# EAGLE design UsbTinyThermometer (EAGLE 5.10)
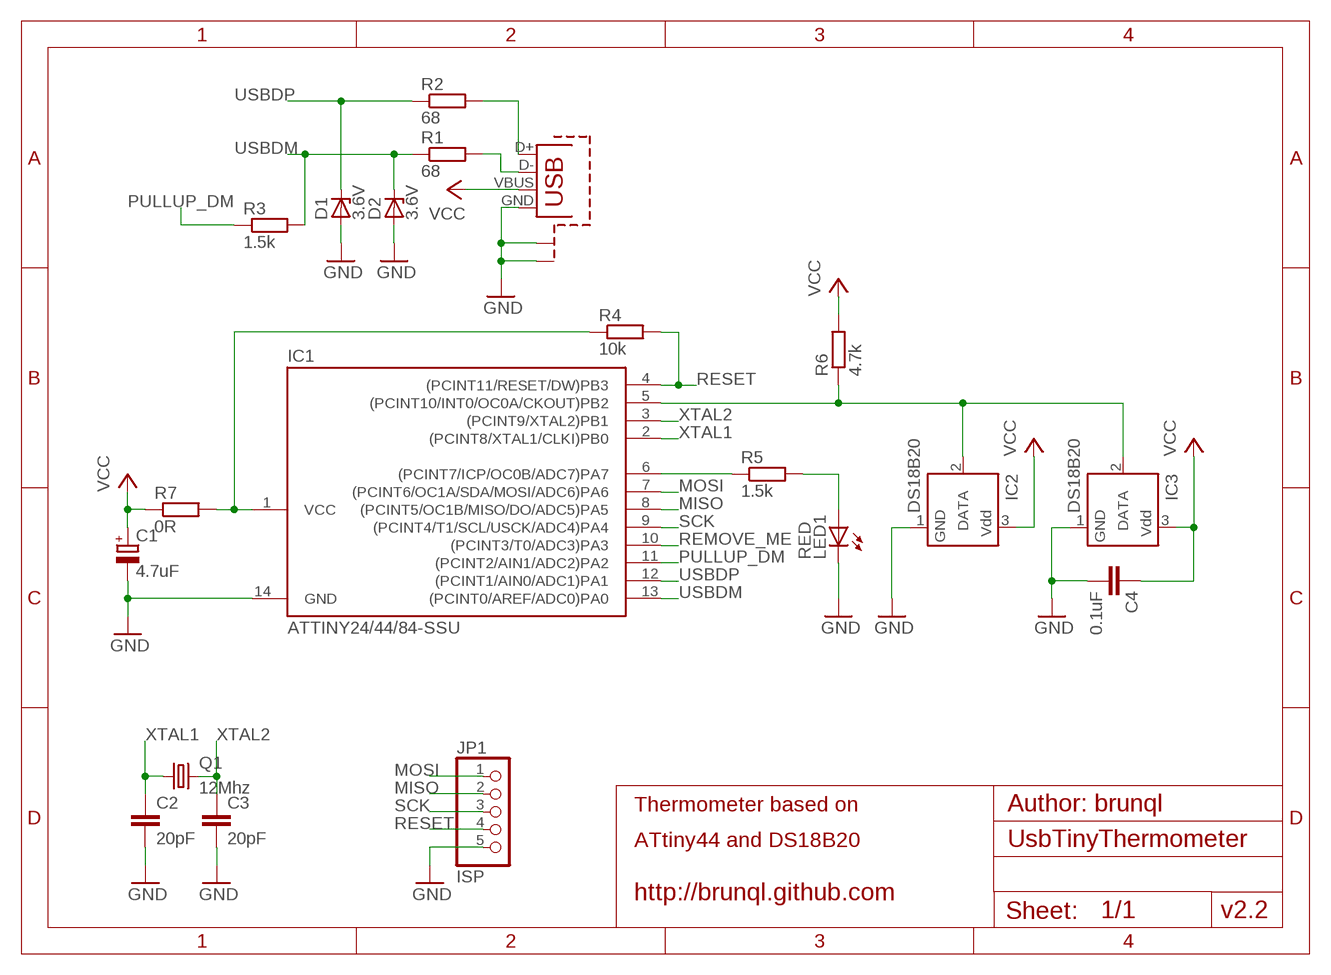
[diagram p0: schematic, sheet 1]

## Parts
C1  4.7uF  CPOL-EUE2.5-5  [E2,5-5]
C2  20pF  C-EUC1206  [C1206]
C3  20pF  C-EUC1206  [C1206]
C4  0.1uF  C-EUC0805  [C0805]
D1  3.6V  ZENER-DIODESMB  [SMB]
D2  3.6V  ZENER-DIODESMB  [SMB]
IC1  ATTINY24/44/84-SSU  [SOIC14]
IC2  DS18B20  [TO92-]
IC3  DS18B20  [TO92-]
JP1  ISP  PINHD-1X5  [1X05]
LED1  RED  LEDCHIP-LED0805  [CHIP-LED0805]
Q1  12Mhz  CRYSTALHC49S  [HC49/S]
R1  68  R-EU_R0805  [R0805]
R2  68  R-EU_R0805  [R0805]
R3  1.5k  R-EU_R0805  [R0805]
R4  10k  R-EU_R0805  [R0805]
R5  1.5k  R-EU_R0805  [R0805]
R6  4.7k  R-EU_M1206  [M1206]
R7  0R  R-EU_M1206  [M1206]
X1  USB-A-H  [USB-A-H]

## Nets
GND: C1.- C2.2 C3.2 C4.2 D1.A D2.A IC1.14(GND) IC2.1(GND) IC3.1(GND) JP1.5 LED1.C X1.GND X1.SHIELD1 X1.SHIELD2
MISO: IC1.8((PCINT5/OC1B/MISO/DO/ADC5)PA5) JP1.2
MOSI: IC1.7((PCINT6/OC1A/SDA/MOSI/ADC6)PA6) JP1.1
N$1: IC1.5((PCINT10/INT0/OC0A/CKOUT)PB2) IC2.2(DATA) IC3.2(DATA) R6.1
N$2: LED1.A R5.2
N$3: IC1.1(VCC) R4.1 R7.2
N$4: R1.2 X1.D-
N$5: R2.2 X1.D+
N$7: IC1.6((PCINT7/ICP/OC0B/ADC7)PA7) R5.1
PULLUP_DM: IC1.11((PCINT2/AIN1/ADC2)PA2) R3.1
REMOVE_ME: IC1.10((PCINT3/T0/ADC3)PA3)
RESET: IC1.4((PCINT11/RESET/DW)PB3) JP1.4 R4.2
SCK: IC1.9((PCINT4/T1/SCL/USCK/ADC4)PA4) JP1.3
USBDM: D2.C IC1.13((PCINT0/AREF/ADC0)PA0) R1.1 R3.2
USBDP: D1.C IC1.12((PCINT1/AIN0/ADC1)PA1) R2.1
VCC: C1.+ C4.1 IC2.3(VDD) IC3.3(VDD) R6.2 R7.1 X1.VBUS
XTAL1: C2.1 IC1.2((PCINT8/XTAL1/CLKI)PB0) Q1.1
XTAL2: C3.1 IC1.3((PCINT9/XTAL2)PB1) Q1.2

## Notes on the sheet
- Thermometer based on | Author: brunql
- ATtiny44 and DS18B20
- http://brunql.github.com
- v2.2

## Library data of the parts
C1 = rcl:CPOL-EU: POLARIZED CAPACITOR, European symbol
C2-C4 = rcl:C-EU: CAPACITOR, European symbol
D1 D2 = diode:ZENER-DIODE: Z-Diode
IC1 = attiny24_44_84:ATTINY24/44/84
IC2 IC3 = dallas:DS18B20: 1-Wire Thermometer DALLAS Semiconductor DS18B20
JP1 = pinhead:PINHD-1X5: PIN HEADER
LED1 = led:LED: LED OSRAM: - CHIPLED LG R971, LG N971, LY N971, LG Q971, LY Q971, LO R971, LY R971 LH N974, LH R974 LS Q976, LO Q976, LY Q976 LO Q996 - Hyper CHIPLED LW Q18S LB Q993, LB Q99A, LB R99A - SideLED LS A670, LO A670, LY A670, LG A670, LP A670 LB A673, LV A673, LT A673, LW A673 LH A674 LY A675 LS A676, LA A676, LO A676, LY A676, LW A676 LS A679, LY A679, LG A679 - Hyper Micro SIDELED® LS Y876, LA Y876, LO Y876, LY Y876 LT Y87S - SmartLED LW L88C, LW L88S LB L89C, LB L89S, LG L890 LS L89K, LO L89K, LY L89K LS L896, LA L896, LO L896, LY L896 - TOPLED LS T670, LO T670, LY T670, LG T670, LP T670 LSG T670, LSP T670, LSY T670, LOP T670, LYG T670 LG T671, LOG T671, LSG T671 LB T673, LV T673, LT T673, LW T673 LH T674 LS T676, LA T676, LO T676, LY T676, LB T676, LH T676, LSB T676, LW T676 LB T67C, LV T67C, LT T67C, LS T67K, LO T67K, LY T67K, LW E67C LS E67B, LA E67B, LO E67B, LY E67B, LB E67C, LV E67C, LT E67C LW T67C LS T679, LY T679, LG T679 LS T770, LO T770, LY T770, LG T770, LP T770 LB T773, LV T773, LT T773, LW T773 LH T774 LS E675, LA E675, LY E675, LS T675 LS T776, LA T776, LO T776, LY T776, LB T776 LHGB T686 LT T68C, LB T68C - Hyper Mini TOPLED® LB M676 - Mini TOPLED Santana® LG M470 LS M47K, LO M47K, LY M47K Source: http://www.osram.convergy.de LUXEON: - LUMILED® LXK2-PW12-R00, LXK2-PW12-S00, LXK2-PW14-U00, LXK2-PW14-V00 LXK2-PM12-R00, LXK2-PM12-S00, LXK2-PM14-U00 LXK2-PE12-Q00, LXK2-PE12-R00, LXK2-PE12-S00, LXK2-PE14-T00, LXK2-PE14-U00 LXK2-PB12-K00, LXK2-PB12-L00, LXK2-PB12-M00, LXK2-PB14-N00, LXK2-PB14-P00, LXK2-PB14-Q00 LXK2-PR12-L00, LXK2-PR12-M00, LXK2-PR14-Q00, LXK2-PR14-R00 LXK2-PD12-Q00, LXK2-PD12-R00, LXK2-PD12-S00 LXK2-PH12-R00, LXK2-PH12-S00 LXK2-PL12-P00, LXK2-PL12-Q00, LXK2-PL12-R00 Source: www.luxeon.com KINGBRIGHT: KA-3528ASYC Source: www.kingbright.com
Q1 = crystal:CRYSTAL: CRYSTAL
R1-R7 = rcl:R-EU_: RESISTOR, European symbol
X1 = con-usb:USB: USB Connectors

## Board
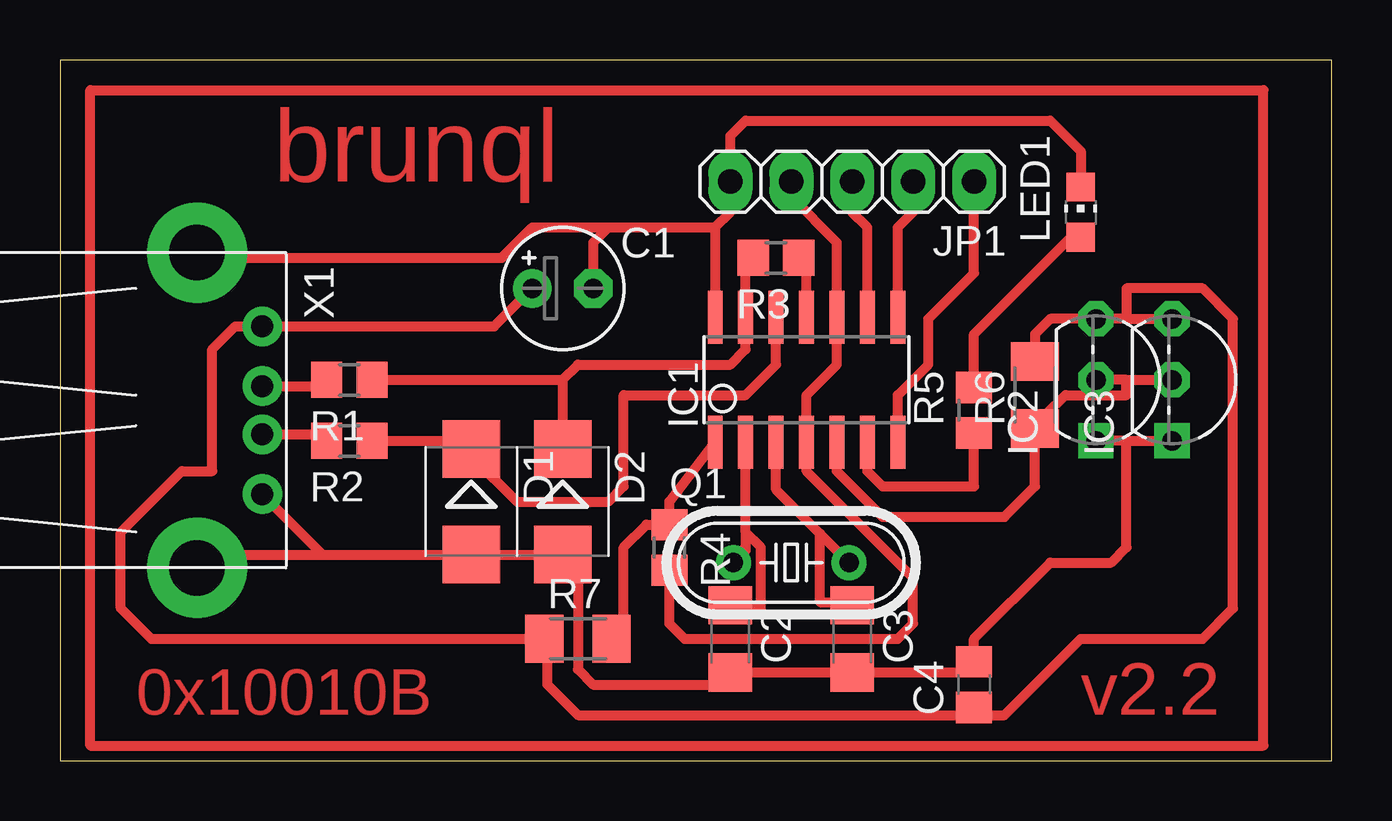
[diagram p1: board, top side]
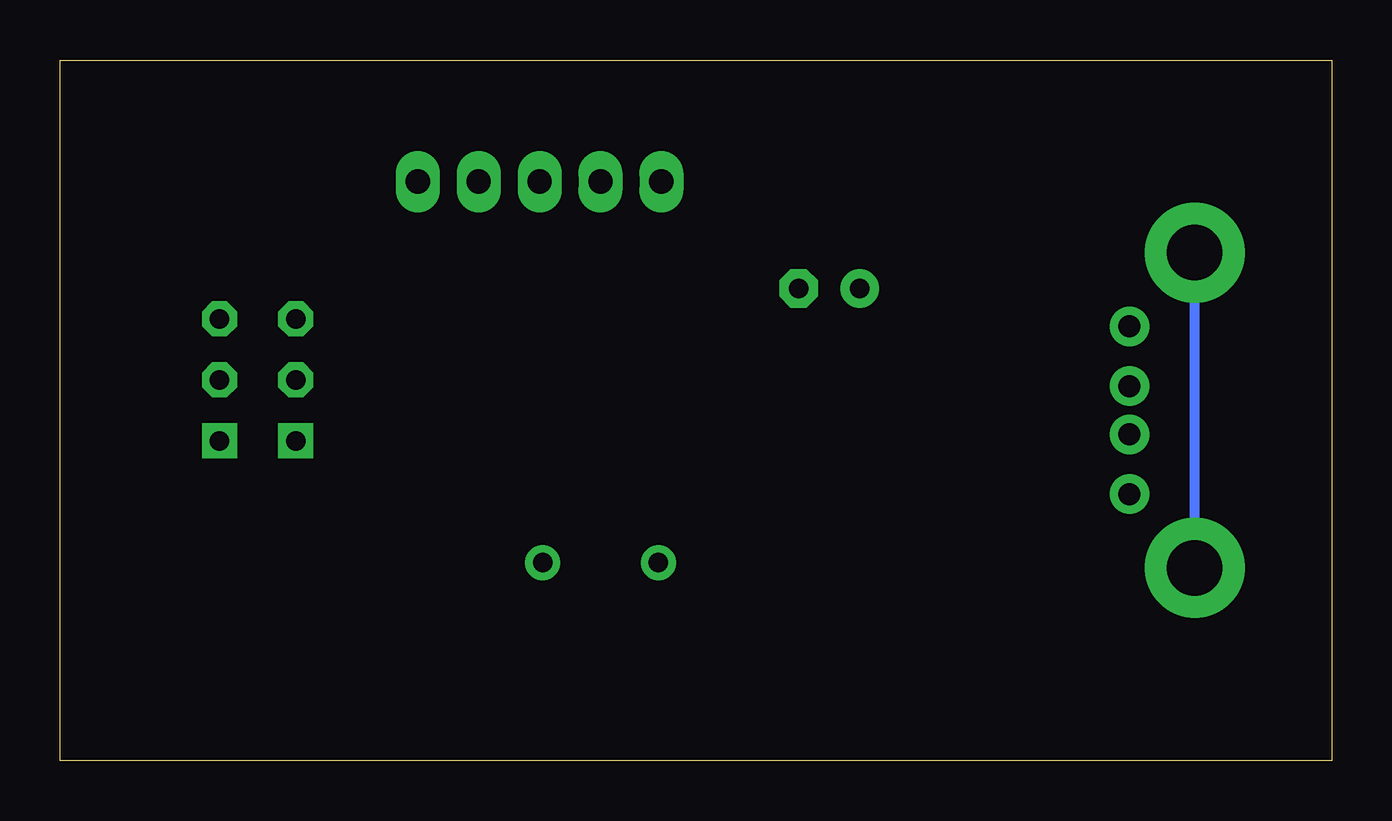
[diagram p2: board, bottom side, seen from below]

Size 53.01 x 29.2 mm. Coordinates in mm from the lower left corner, seen from the top.
Outline: 0,0 53.01,0 53.01,29.2 0,29.2 0,0
Copper layers (1*16): Top 0.035mm / dielectric 1.5mm / Bottom 0.035mm
Design rules "brunql *": minimum track width 0.3mm, minimum drill 0.8mm, track to track 0.2mm, track to pad 0.3mm, pad to pad 0.3mm, via to via 0.3mm, smd to smd 0.2mm, copper to edge 2mm, drill to drill 1mm, minimum pad ring 0.2mm, minimum via ring 8mil, stop-mask expansion 4mil, vias tented up to drill 0mil, thermal gap 0.2mm

### Footprints (pad centres in the part's own frame; a part is rotated, then mirrored left to right if it is on the bottom)
E2,5-5 = drill 0.813 pad 1.6 round: + -1.27,0 | drill 0.813 pad 1.6 octagon: - 1.27,0
C1206 = smd 1.6 x 1.8: 1 -1.4,0; 2 1.4,0
C0805 = smd 1.3 x 1.5: 1 -0.95,0; 2 0.95,0
SMB = smd 2.4 x 2.4: A 2.2,0; C -2.2,0
SOIC14 = smd 0.61 x 2.21: 1 -3.81,-2.603; 2 -2.54,-2.603; 3 -1.27,-2.603; 4 0,-2.603; 5 1.27,-2.603; 6 2.54,-2.603; 7 3.81,-2.603; 8 3.81,2.603; 9 2.54,2.603; 10 1.27,2.603; 11 0,2.603; 12 -1.27,2.603; 13 -2.54,2.603; 14 -3.81,2.603
TO92- = drill 0.813 square: 1 -2.54,1.27 | drill 0.813 octagon: 2 0,1.27; 3 2.54,1.27
1X05 = drill 1.016 long: 1 -5.08,0; 2 -2.54,0; 3 0,0; 4 2.54,0; 5 5.08,0
CHIP-LED0805 = smd 1.2 x 1.2: A 0,-1.05; C 0,1.05
HC49/S = drill 0.813 round: 1 -2.413,0; 2 2.413,0
R0805 = smd 1.3 x 1.5: 1 -0.95,0; 2 0.95,0
M1206 = smd 1.6 x 2: 1 -1.4,0; 2 1.4,0
USB-A-H = drill 0.914 round: D+ 2.718,-1.003; D- 2.718,1.003; GND 2.718,-3.493; VBUS 2.718,3.493 | drill 2.311 round: SHIELD1 0,6.566; SHIELD2 0,-6.566

### Placement (x,y rotation side)
C1  20.95,19.68 0 top
C2  27.94,5.08 270 top
C3  33.02,5.08 270 top
C4  38.1,3.17 90 top
D1  17.14,10.79 270 top
D2  20.95,10.79 270 top
IC1  31.11,15.88 0 top
IC2  44.45,15.88 90 top
IC3  47.62,15.88 90 top
JP1  33.02,24.13 180 top
LED1  42.55,22.86 0 top
Q1  30.48,8.26 0 top
R1  12.06,15.88 180 top
R2  12.06,13.34 180 top
R3  29.84,20.95 180 top
R4  25.4,8.89 270 top
R5  38.1,14.61 90 top
R6  40.64,15.24 90 top
R7  21.59,5.08 0 top
X1  5.71,14.61 0 top

### Tracks (layer width: path | path; a pad name or v marks a point on that pad's centre or on a via)
GND
  Top 0.406: 10.95,8.6 D1.A D2.A 20.95,8.26 21.59,7.62 21.59,3.81 22.23,3.17 27.43,3.17 C2.2 C3.2 37.66,3.68 37.78,3.81 38.1,3.81 C4.2 38.1,5.08 41.27,8.26 43.81,8.26 44.45,8.89 44.45,13.34 | 10.95,8.6 X1.GND | X1.SHIELD2 6.27,8.6 10.95,8.6 | LED1.C 42.55,25.4 41.27,26.67 28.57,26.67 27.94,26.04 JP1.5 27.94,22.86 27.3,22.23 | 27.3,22.23 IC1.14 | 22.86,22.23 27.3,22.23 | C1.- 22.23,21.59 22.86,22.23 | 22.86,22.23 19.68,22.23 18.41,20.95 5.93,20.95 X1.SHIELD1 | 44.45,13.34 IC2.1 | 44.45,13.34 IC3.1
  Bottom 0.406: X1.SHIELD2 X1.SHIELD1
MISO
  Top 0.406: JP1.2 35.56,22.86 34.92,22.23 IC1.8
MOSI
  Top 0.406: JP1.1 38.1,20.32 36.2,18.41 36.2,16.51 34.92,15.24 IC1.7
N$1
  Top 0.406: IC1.5 32.38,12.06 34.29,10.16 39.37,10.16 40.64,11.43 R6.1 41.15,13.84 41.15,14.47 41.91,15.24 44.45,15.24 44.45,15.88 | 44.45,15.88 IC2.2 | 44.45,15.88 IC3.2
N$2
  Top 0.406: LED1.A 42.13,21.81 38.1,17.78 R5.2
N$3
  Top 0.406: IC1.1 25.4,10.79 R4.1 24.45,9.84 23.5,8.89 23.5,5.58 R7.2
N$4
  Top 0.406: X1.D- 10.85,15.61 R1.2
N$5
  Top 0.406: X1.D+ 10.85,13.6 R2.2
N$7
  Top 0.406: IC1.6 33.66,12.06 34.29,11.43 38.1,11.43 R5.1
N$16
  Top 0.406: 1.27,27.94 50.16,27.94 50.16,0.64 1.27,0.64 1.27,27.94
PULLUP_DM
  Top 0.406: IC1.11 31.11,20.32 30.8,20.64 R3.1
RESET
  Top 0.406: R4.2 25.4,5.71 26.04,5.08 34.92,5.08 35.56,5.71 35.56,7.62 31.11,12.06 IC1.4 31.11,15.24 32.38,16.51 32.38,21.59 30.48,23.5 JP1.4
SCK
  Top 0.406: JP1.3 33.02,22.86 33.66,22.23 IC1.9
USBDM
  Top 0.406: R1.1 20.95,15.88 | 20.95,15.88 D2.C | 20.95,15.88 21.59,16.51 27.94,16.51 28.57,17.14 IC1.13 | IC1.13 28.57,19.05 | R3.2 28.57,20.95 IC1.13
USBDP
  Top 0.406: R2.1 16.8,13.34 D1.C 17.14,12.7 19.05,10.79 22.86,10.79 23.5,11.43 23.5,15.24 28.57,15.24 29.84,16.51 IC1.12
VCC
  Top 0.406: C1.+ 18.1,18.1 X1.VBUS 7.3,18.1 6.35,17.14 6.35,12.06 5.08,12.06 2.54,9.53 2.54,6.35 3.81,5.08 R7.1 20.32,5.21 | 20.32,5.08 19.68,5.71 | 38.73,1.91 21.59,1.91 20.32,3.17 20.32,5.08 | 38.73,1.91 39.37,1.91 42.55,5.08 47.62,5.08 48.9,6.35 48.9,18.41 47.62,19.68 44.45,19.68 44.45,18.41 | 44.45,18.41 IC2.3 41.27,18.41 40.64,17.78 R6.2 | 44.45,18.41 IC3.3 | C4.1 38.41,2.23 38.73,1.91 | 20.32,5.08 20.32,5.21 | 20.32,5.71 20.32,5.21
XTAL1
  Top 0.406: 28.57,8.89 28.57,8.76 Q1.1 28.07,8.38 28.57,8.89 | 28.57,9.53 IC1.2 | 28.07,6.61 C2.1 28.07,6.35 29.21,6.35 29.21,8.89 28.57,9.53 | 28.57,9.53 28.57,8.89
XTAL2
  Top 0.406: IC1.3 29.84,11.3 31.69,9.46 | 31.69,9.46 Q1.2 | C3.1 32.89,6.61 31.69,6.61 31.69,9.46

### Text on the board
Top: brunql | 0x10010B | v2.2